# EAGLE design satshakit_FabPCBMaker (EAGLE 8.0.1)
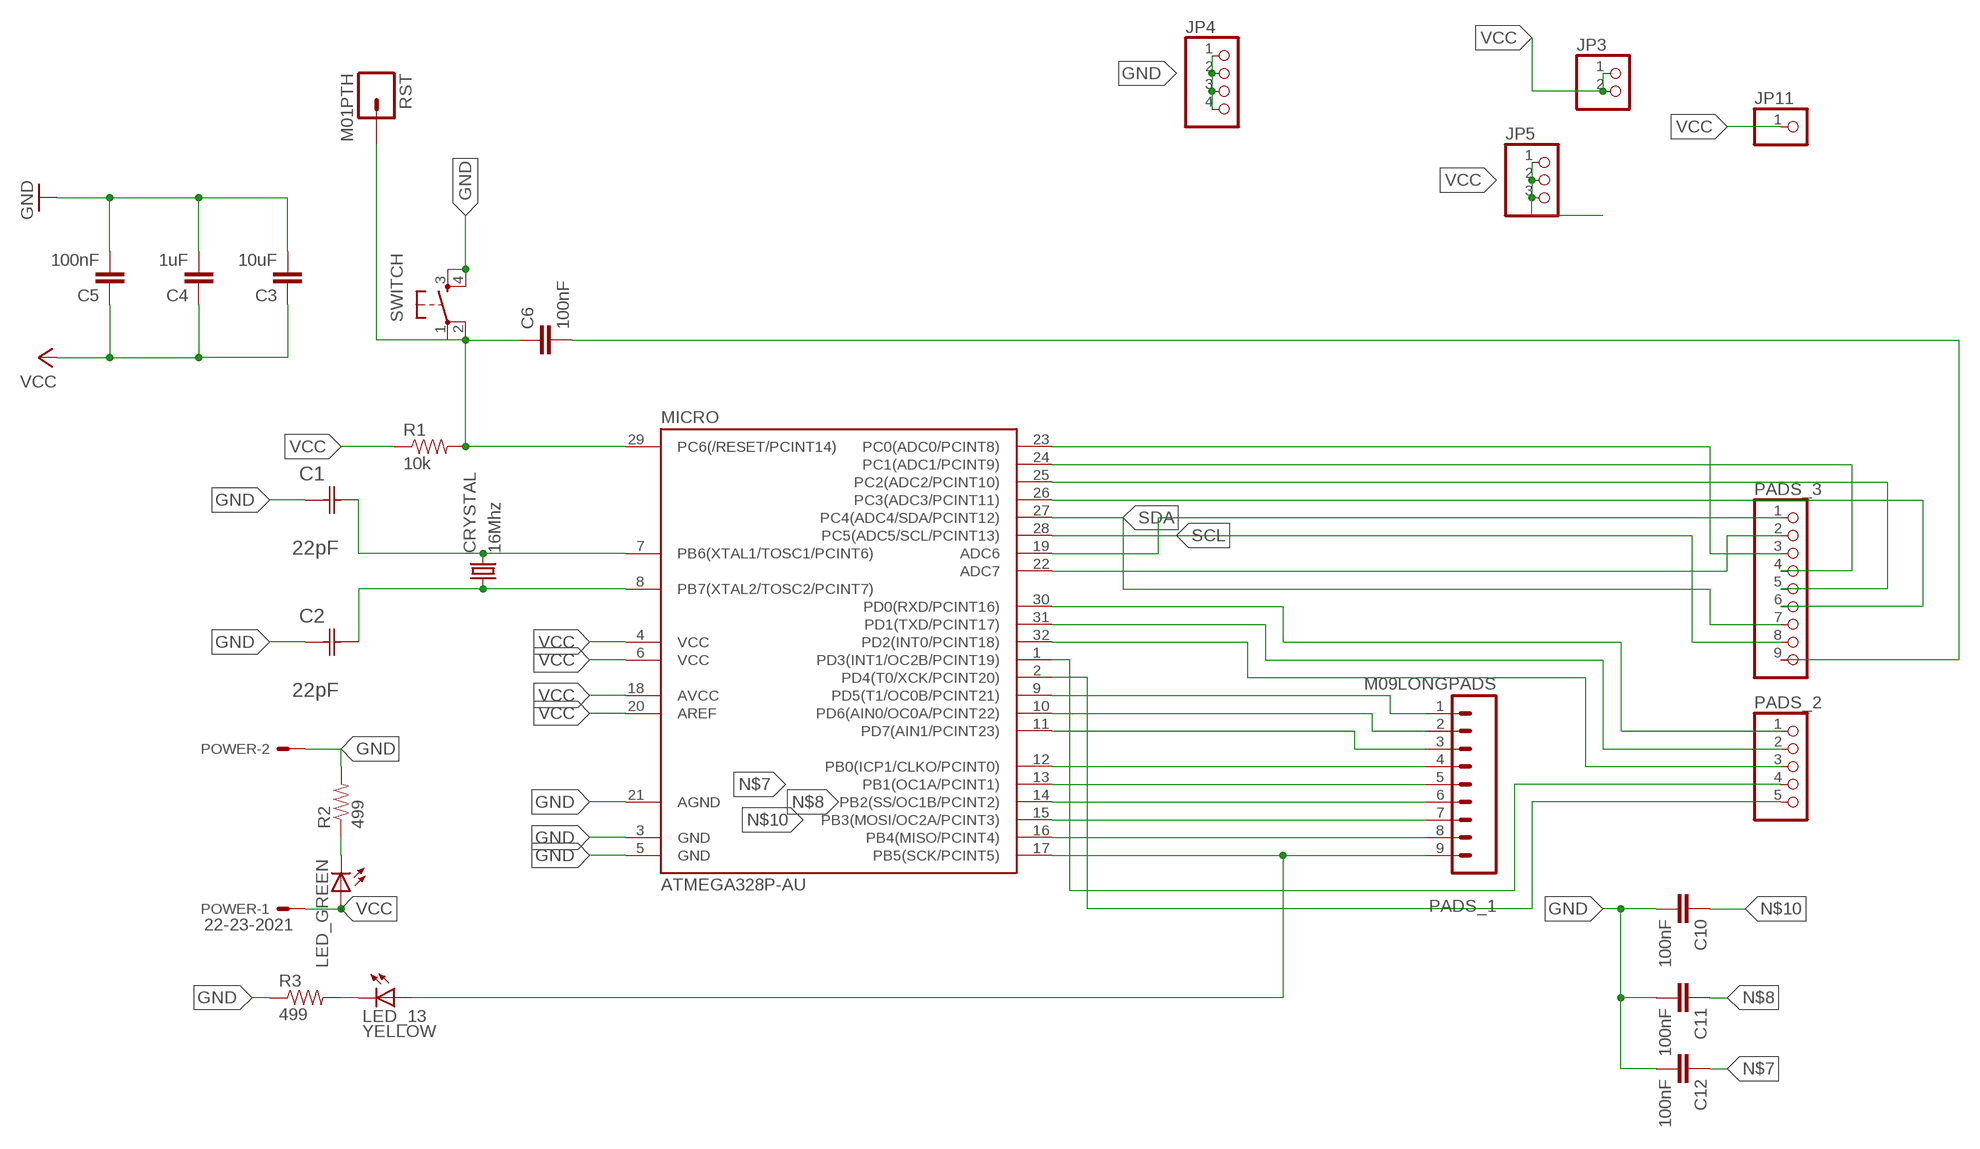
[diagram p0: schematic, sheet 1]

## Parts
C1  22pF  0612ZC225MAT2A  [CAPC3216X178N]
C2  22pF  0612ZC225MAT2A  [CAPC3216X178N]
C3  10uF  CAP1206  [1206]
C4  1uF  CAP1206  [1206]
C5  100nF  CAP1206  [1206]
C6  100nF  CAP1206  [1206]
C10  100nF  CAP1206  [1206]
C11  100nF  CAP1206  [1206]
C12  100nF  CAP1206  [1206]
CRYSTAL  16Mhz  CSM-7X-DU  [CSM-7X-DU]
JP3  PINHD-1X2  [1X02]
JP4  PINHD-1X4  [1X04]
JP5  PINHD-1X3  [1X03]
JP11  PINHD-1X1  [1X01]
LED_13  YELLOW  LED1206  [1206]
LED_GREEN  LED1206  [1206]
MICRO  ATMEGA328P-AU  ATMEGA48/88/168-AU  [TQFP32-08]
PADS_1  M09LONGPADS  [1X09_LONGPADS]
PADS_2  PINHD-1X5  [1X05]
PADS_3  PINHD-1X9  [1X09]
POWER  22-23-2021  [22-23-2021]
R1  10k  RESISTOR1206  [1206]
R2  499  RESISTOR1206  [1206]
R3  499  RESISTOR1206  [1206]
RST  M01PTH  [1X01]
SWITCH  6MM_SWITCH6MM_SWITCH  [6MM_SWITCH]

## Nets
GND: C1.1(C1) C2.1(C1) C3.2 C4.2 C5.2 C10.2 C11.2 C12.2 JP4.1 JP4.2 JP4.3 JP4.4 MICRO.3(GND) MICRO.5(GND) MICRO.21(AGND) POWER.2 R2.2 R3.1 SWITCH.3(S) SWITCH.4(S1)
N$1: MICRO.9(PD5(T1/OC0B/PCINT21)) PADS_1.1
N$2: C1.2(C2) CRYSTAL.2 MICRO.7(PB6(XTAL1/TOSC1/PCINT6))
N$3: C6.2 PADS_3.9
N$4: MICRO.10(PD6(AIN0/OC0A/PCINT22)) PADS_1.2
N$5: MICRO.11(PD7(AIN1/PCINT23)) PADS_1.3
N$6: MICRO.12(PB0(ICP1/CLKO/PCINT0)) PADS_1.4
N$7: C12.1 MICRO.13(PB1(OC1A/PCINT1)) PADS_1.5
N$8: C11.1 MICRO.14(PB2(SS/OC1B/PCINT2)) PADS_1.6
N$9: C2.2(C2) CRYSTAL.1 MICRO.8(PB7(XTAL2/TOSC2/PCINT7))
N$10: C10.1 MICRO.15(PB3(MOSI/OC2A/PCINT3)) PADS_1.7
N$11: MICRO.16(PB4(MISO/PCINT4)) PADS_1.8
N$12: LED_13.1(A) MICRO.17(PB5(SCK/PCINT5)) PADS_1.9
N$13: MICRO.19(ADC6) PADS_3.1
N$14: MICRO.22(ADC7) PADS_3.2
N$15: MICRO.23(PC0(ADC0/PCINT8)) PADS_3.3
N$16: MICRO.24(PC1(ADC1/PCINT9)) PADS_3.4
N$17: MICRO.25(PC2(ADC2/PCINT10)) PADS_3.5
N$18: MICRO.26(PC3(ADC3/PCINT11)) PADS_3.6
N$20: MICRO.30(PD0(RXD/PCINT16)) PADS_2.1
N$21: MICRO.31(PD1(TXD/PCINT17)) PADS_2.2
N$22: MICRO.32(PD2(INT0/PCINT18)) PADS_2.3
N$23: MICRO.1(PD3(INT1/OC2B/PCINT19)) PADS_2.4
N$24: MICRO.2(PD4(T0/XCK/PCINT20)) PADS_2.5
N$26: LED_GREEN.2(C) R2.1
N$27: LED_13.2(C) R3.2
N$28: C6.1 MICRO.29(PC6(/RESET/PCINT14)) R1.2 RST.1 SWITCH.1(P) SWITCH.2(P1)
SCL: MICRO.28(PC5(ADC5/SCL/PCINT13)) PADS_3.8
SDA: MICRO.27(PC4(ADC4/SDA/PCINT12)) PADS_3.7
VCC: C3.1 C4.1 C5.1 JP3.1 JP3.2 JP5.1 JP5.2 JP5.3 JP11.1 LED_GREEN.1(A) MICRO.4(VCC) MICRO.6(VCC) MICRO.18(AVCC) MICRO.20(AREF) POWER.1 R1.1

## Library data of the parts
C1 C2 = AVX_By_element14_Batch_1:0612ZC225MAT2A: Capacitor 1206; MPN: 0612ZC225MAT2A; OC_FARNELL: -; OC_NEWARK: 12N3209; SUPPLIER: AVX; TOLERANCE: ±20%; VALUE: 2.2µF; VOLTAGERATING: 10V
C3-C6 C10-C12 = 01_SparkFun:CAP: Capacitor Standard 0603 ceramic capacitor, and 0.1" leaded capacitor.
CRYSTAL = 01_FAB_Hello:CSM-7X-DU: SMD CRYSTAL Source: www.ecsxtal.com .. Crystal 3.6864MHz CSM_7X_DU.PDF; OC_FARNELL: unknown; OC_NEWARK: unknown
JP3 = pinhead:PINHD-1X2: PIN HEADER
JP4 = pinhead:PINHD-1X4: PIN HEADER
JP5 = pinhead:PINHD-1X3: PIN HEADER
JP11 = pinhead:PINHD-1X1: PIN HEADER
LED_13 LED_GREEN = 01_FAB_Hello:LED
MICRO = atmega8:ATMEGA48/88/168
PADS_1 = 01_SparkFun:M09: Header 9 Standard 9-pin 0.1" header. Use with straight break away headers (SKU : PRT-00116), right angle break away headers (PRT-00553), swiss pins (PRT-00743), machine pins (PRT-00117), and female headers (PRT-00115).
PADS_2 = pinhead:PINHD-1X5: PIN HEADER
PADS_3 = pinhead:PINHD-1X9: PIN HEADER
POWER = con-molex:22-23-2021: .100" (2.54mm) Center Header - 2 Pin; MF: MOLEX; MPN: 22-23-2021; OC_FARNELL: 1462926; OC_NEWARK: 25C3832
R1-R3 = 01_SparkFun:RESISTOR: Resistor Basic schematic elements and footprints for 0603, 1206, and PTH 1/10th watt (small) resistors.
RST = 01_SparkFun:M01: Header 1 Standard 1-pin 0.1" header. Use with straight break away headers (SKU : PRT-00116), right angle break away headers (PRT-00553), swiss pins (PRT-00743), machine pins (PRT-00117), and female headers (PRT-00115).
SWITCH = 01_FAB_Hello:6MM_SWITCH: OMRON SWITCH

## Board
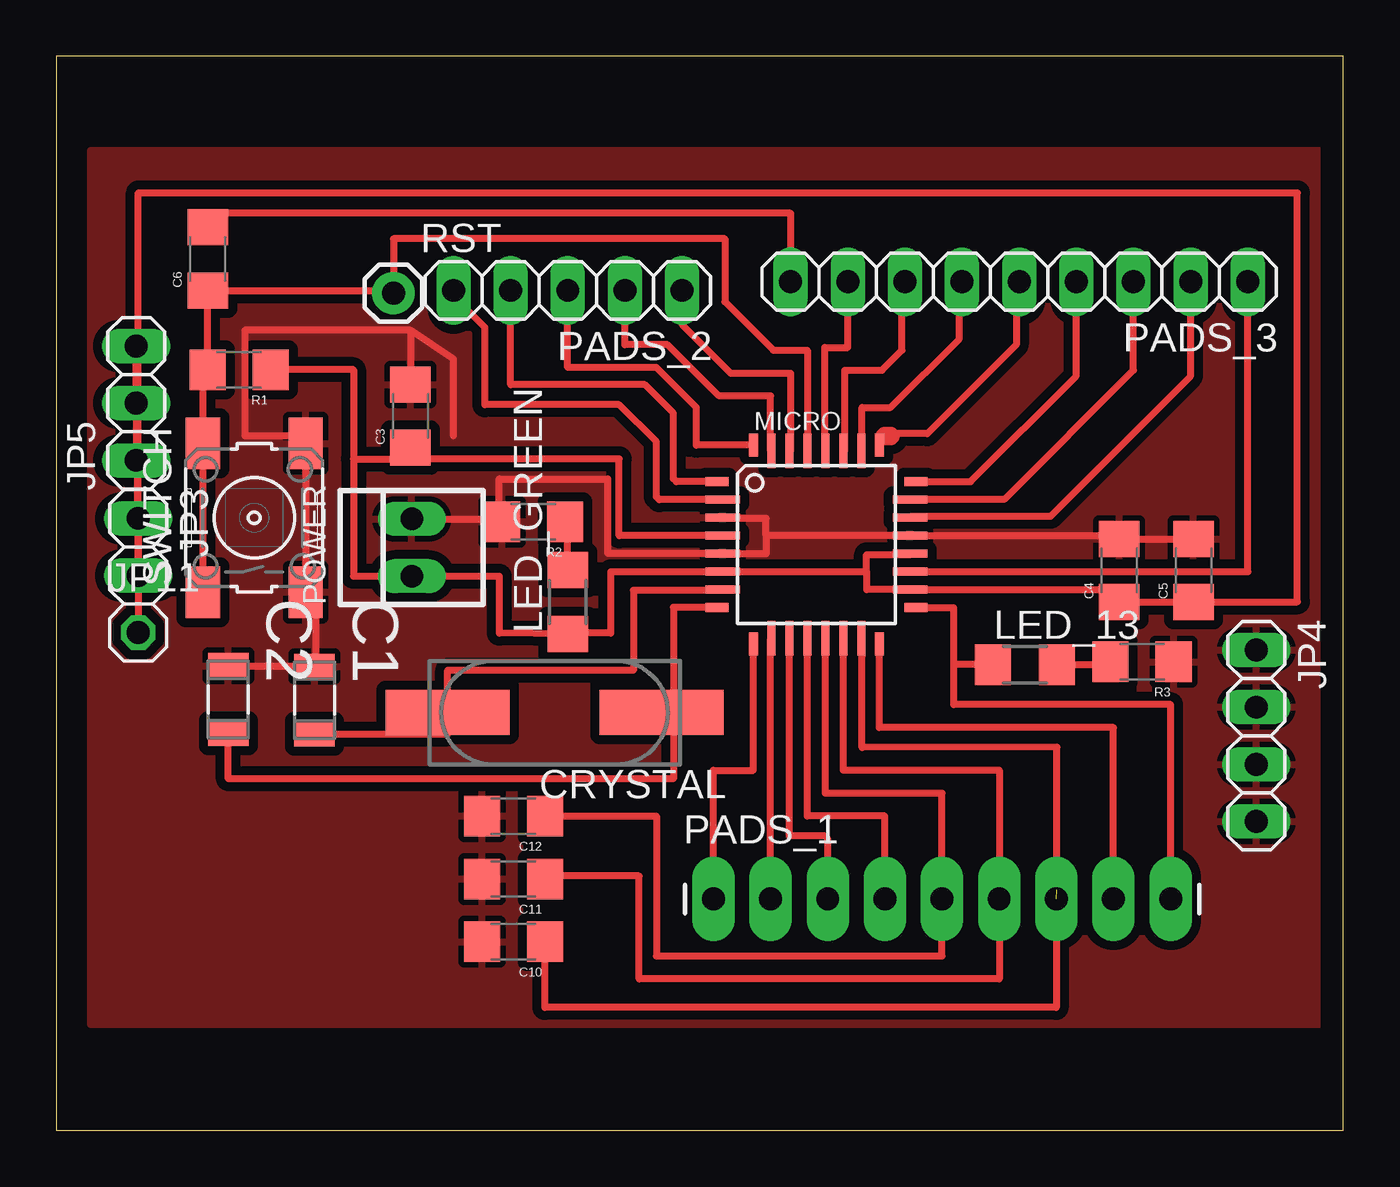
[diagram p1: board, top side]

Size 57.2 x 47.74 mm. Coordinates in mm from the lower left corner, seen from the top.
Outline: 0,0 57.2,0 57.2,47.74 0,47.74 0,0
Copper layers (1*16): Top 0.035mm / dielectric 1.5mm / Bottom 0.035mm
Design rules "default": minimum track width 10mil, minimum drill 24mil, track to track 8mil, track to pad 8mil, pad to pad 8mil, via to via 8mil, smd to smd 8mil, copper to edge 40mil, drill to drill 8mil, minimum pad ring 10mil, minimum via ring 8mil, stop-mask expansion 4mil, vias tented up to drill 0mil, thermal gap 10mil

### Footprints (pad centres in the part's own frame; a part is rotated, then mirrored left to right if it is on the bottom)
CAPC3216X178N = smd 1.118 x 1.803: 1 -1.499,0; 2 1.499,0
1206 = smd 1.6 x 1.8: 1 -1.4,0; 2 1.4,0
CSM-7X-DU = smd 5.5 x 2: 1 -4.75,0; 2 4.75,0
1X02 = drill 1.016 long: 1 -1.27,0; 2 1.27,0
1X04 = drill 1.016 long: 1 -3.81,0; 2 -1.27,0; 3 1.27,0; 4 3.81,0
1X03 = drill 1.016 long: 1 -2.54,0; 2 0,0; 3 2.54,0
1X01 = drill 1.016 octagon: 1 0,0
1206' = smd 1.6 x 1.803: 1 -1.422,0; 2 1.422,0
TQFP32-08 = smd 1.016 x 0.406: 1 -4.42,2.8; 8 -4.42,-2.8; 17 4.42,-2.8; 24 4.42,2.8 | smd 1.524 x 0.356: 2 -4.166,2; 3 -4.166,1.2; 4 -4.166,0.4; 5 -4.166,-0.4; 6 -4.166,-1.2; 7 -4.166,-2; 18 4.166,-2; 19 4.166,-1.2; 20 4.166,-0.4; 21 4.166,0.4; 22 4.166,1.2; 23 4.166,2 | smd 0.406 x 1.016: 9 -2.8,-4.42; 16 2.8,-4.42; 25 2.8,4.42; 32 -2.8,4.42 | smd 0.356 x 1.524: 10 -2,-4.166; 11 -1.2,-4.166; 12 -0.4,-4.166; 13 0.4,-4.166; 14 1.2,-4.166; 15 2,-4.166; 26 2,4.166; 27 1.2,4.166; 28 0.4,4.166; 29 -0.4,4.166; 30 -1.2,4.166; 31 -2,4.166
1X09_LONGPADS = drill 1.016 pad 1.88 long: 1 0,0; 2 2.54,0; 3 5.08,0; 4 7.62,0; 5 10.16,0; 6 12.7,0; 7 15.24,0; 8 17.78,0; 9 20.32,0
1X05 = drill 1.016 long: 1 -5.08,0; 2 -2.54,0; 3 0,0; 4 2.54,0; 5 5.08,0
1X09 = drill 1.016 long: 1 -10.16,0; 2 -7.62,0; 3 -5.08,0; 4 -2.54,0; 5 0,0; 6 2.54,0; 7 5.08,0; 8 7.62,0; 9 10.16,0
22-23-2021 = drill 1 long: 1 -1.27,0; 2 1.27,0
1X01' = drill 1.016 pad 1.88: 1 0,0
6MM_SWITCH = smd 2.286 x 1.524: 1 -3.302,2.286; 2 3.302,2.286; 3 -3.302,-2.286; 4 3.302,-2.286

### Placement (x,y rotation side)
C1  11.48,19.13 270 top
C2  7.65,19.15 270 top
C3  15.75,31.75 90 top
C4  47.24,24.89 90 top
C5  50.55,24.89 90 top
C6  6.73,38.73 90 top
C10  20.32,8.38 180 top
C11  20.32,11.18 180 top
C12  20.32,13.97 180 top
CRYSTAL  22.15,18.57 180 top
JP3  3.64,25.93 270 top
JP4  53.34,17.54 270 top
JP5  3.56,32.32 90 top
JP11  3.64,22.12 0 top
LED_13  YELLOW  [1206']  43.05,20.7 0 top
LED_GREEN  [1206']  22.73,23.5 90 top
MICRO  33.78,26.04 0 top
PADS_1  29.21,10.29 0 top
PADS_2  22.73,37.34 180 top
PADS_3  42.8,37.72 180 top
POWER  15.8,25.91 90 top
R1  8.13,33.81 180 top
R2  21.21,27.05 180 top
R3  48.26,20.83 180 top
RST  M01PTH  [1X01']  14.99,37.21 0 top
SWITCH  8.8,27.23 90 top

### Tracks (layer width: path | path; a pad name or v marks a point on that pad's centre or on a via)
GND
  Top 0.254: MICRO.3 29.64,27.21 | 30.23,25.65 30.48,25.65
  Top 0.305: MICRO.5 | MICRO.21 | MICRO.5 29.62,25.65 24.51,25.65 24.51,28.96 19.69,28.96 19.69,26.92 20.32,26.92 R2.2 20.32,27.18 POWER.2 | MICRO.21 47.24,26.43 C4.2 C5.2 | 30.23,25.65 MICRO.5 | MICRO.21 37.34,26.42 | 17.65,30.86 17.65,34.29 15.75,35.56 | 15.75,35.56 C3.2 | 15.75,35.56 8.38,35.56 8.38,30.86 11.05,30.86 | 11.05,30.86 11.05,31.17 SWITCH.4 SWITCH.3 11.56,23.93 11.56,20.62 C1.1 11.74,20.65 C2.1 | 11.05,30.86 11.05,29.72 | MICRO.5 31.55,25.64 31.55,26.43 | 31.55,26.43 31.55,27.2 29.62,27.2 MICRO.3 | MICRO.21 31.55,26.43
  pour Top (isolate 0.406): 56.39,4.7 1.52,4.7 1.52,43.56 56.39,43.56
N$1
  Top 0.305: MICRO.9 30.98,16 29.21,16 PADS_1.1
N$2
  Top 0.305: MICRO.7 29.62,24 25.65,24 25.65,20.45 17.4,20.45 CRYSTAL.2 17.4,17.63 C1.2
N$3
  Top 0.305: PADS_3.9 32.64,40.77 6.73,40.77 C6.2
N$4
  Top 0.305: PADS_1.2 31.75,21.84 MICRO.10
N$5
  Top 0.305: MICRO.11 32.58,13.08 34.16,13.08 34.29,12.95 PADS_1.3
N$6
  Top 0.305: 33.4,21.87 MICRO.12 33.38,13.97 36.83,13.97 PADS_1.4
N$7
  Top 0.305: MICRO.13 34.18,14.99 39.37,14.99 PADS_1.5 39.37,7.75 26.67,7.75 26.67,13.97 C12.1
N$8
  Top 0.305: MICRO.14 34.98,16 41.91,16 PADS_1.6 41.91,6.73 25.91,6.73 25.91,11.3 21.72,11.3 C11.1
N$9
  Top 0.305: MICRO.8 27.43,23.24 27.43,18.67 26.9,18.67 CRYSTAL.1 27.43,18.31 27.43,15.62 7.65,15.62 C2.2
N$10  (1 unrouted)
  Top 0.305: 44.48,10.68 44.48,17.03 35.81,17.02 35.81,21.08 MICRO.15 | PADS_1.7 44.45,5.46 21.72,5.46 C10.1
N$11
  Top 0.305: MICRO.16 36.58,17.91 46.99,17.91 PADS_1.8
N$12
  Top 0.305: 39.88,20.7 39.88,18.92 49.53,18.92 PADS_1.9 | LED_13.1 39.88,20.7 | MICRO.17 39.88,23.23 39.88,20.7
N$13
  Top 0.305: MICRO.19 52.96,24.84 PADS_3.1
N$14
  Top 0.305: MICRO.22 38.02,27.3 44.2,27.3 50.42,33.53 PADS_3.2
N$15
  Top 0.305: MICRO.23 37.98,28.07 42.16,28.07 47.88,33.78 PADS_3.3
N$16
  Top 0.305: PADS_3.4 45.34,33.53 40.64,28.83 MICRO.24
N$17
  Top 0.305: MICRO.25 36.58,30.86 36.83,30.86 | 37.08,30.86 37.08,30.96 38.71,30.96 42.67,34.92 42.67,37.59 PADS_3.5
  Top 0.813: 37.08,30.86 36.83,30.86
N$18
  Top 0.305: MICRO.26 35.81,30.2 35.81,32.13 37.08,32.13 40.13,35.18 40.13,37.59 PADS_3.6
N$20
  Top 0.305: MICRO.30 32.64,30.2 32.64,33.66 29.97,33.66 27.81,35.81 PADS_2.1
N$21
  Top 0.305: MICRO.31 31.75,30.2 31.75,32.64 29.46,32.64 27.18,34.92 25.27,34.92 PADS_2.2
N$22
  Top 0.305: MICRO.32 28.45,30.45 28.45,32.13 26.67,33.91 22.73,33.91 PADS_2.3
N$23
  Top 0.305: MICRO.1 27.56,28.84 27.43,28.96 27.43,31.88 26.16,33.15 20.19,33.15 PADS_2.4
N$24
  Top 0.305: MICRO.2 26.8,28.04 26.67,28.16 26.67,30.61 25.02,32.26 19.05,32.26 19.05,35.69 17.65,37.08 PADS_2.5
N$26
  Top 0.305: 22.99,26.8 R2.1 22.61,26.67 22.73,26.67 LED_GREEN.2
N$27
  Top 0.305: LED_13.2 46.86,20.7 R3.2
N$28
  Top 0.305: 33.4,30.2 MICRO.29 33.38,34.67 31.88,34.67 29.72,36.83 29.72,39.62 14.99,39.62 RST.1 14.99,37.34 C6.1 R1.2 6.51,33.81 SWITCH.2 SWITCH.1
SCL
  Top 0.305: MICRO.28 34.16,30.2 34.16,34.8 35.18,34.8 PADS_3.8
SDA
  Top 0.305: MICRO.27 35.05,30.2 35.05,33.78 36.7,33.78 37.59,34.67 37.59,37.59 PADS_3.7 37.72,37.84
VCC
  Top 0.254: MICRO.20 37.34,25.64 37.34,25.65
  Top 0.305: MICRO.18 | MICRO.20 | MICRO.4 25.02,26.43 25.02,29.84 15.75,29.84 | 13.21,29.84 13.21,33.81 R1.1 | 13.21,29.84 13.21,24.64 POWER.1 19.69,24.64 19.69,22.1 LED_GREEN.1 22.1,22.1 24.64,22.1 24.64,24.84 MICRO.6 | 37.95,24 MICRO.18 | MICRO.20 37.34,25.65 | 30.3,24.84 MICRO.6 | 13.21,29.84 15.75,29.84 | 15.75,29.84 C3.1 | 50.55,23.4 C5.1 | 3.64,29.78 3.64,41.68 55.17,41.68 55.17,23.49 C5.1 | 3.64,26.61 3.64,29.78 | 3.64,26.61 JP11.1 | JP3.2 JP3.1 3.63,27.3 | MICRO.18 47.24,24.04 C4.1 C5.1 | MICRO.18 36.02,24.04 36.02,24.84 | 36.02,24.84 36.02,25.59 37.95,25.59 MICRO.20 | MICRO.6 36.02,24.84 | 3.64,29.78 JP5.3 JP5.2 | 3.63,27.3 3.64,26.61 | 3.63,27.3 JP5.2 | JP5.2 JP5.1